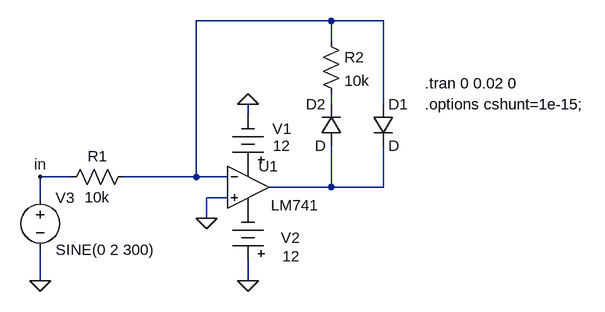
[diagram p0: schematic exp3.asc]
exp3.asc, the LTspice schematic file:
Version 4.1
SHEET 1 1000 780
WIRE 272 -112 64 -112
WIRE 352 -112 272 -112
WIRE 272 -80 272 -112
WIRE 272 16 272 0
WIRE 352 16 352 -112
WIRE 144 32 144 16
WIRE -128 128 -176 128
WIRE 64 128 64 -112
WIRE 64 128 -48 128
WIRE 112 128 64 128
WIRE 272 144 272 80
WIRE 272 144 176 144
WIRE 352 144 352 80
WIRE 352 144 272 144
WIRE -176 160 -176 128
WIRE 112 160 80 160
WIRE 80 192 80 160
WIRE -176 288 -176 240
WIRE 144 288 144 256
FLAG 144 288 0
FLAG 144 16 0
FLAG -176 288 0
FLAG -176 128 in
FLAG 80 192 0
SYMBOL OpAmps\\LM741 144 80 R0
WINDOW 3 35 92 Left 2
SYMATTR InstName U1
SYMBOL Misc\\battery 144 128 R180
WINDOW 0 -67 74 Left 2
WINDOW 3 -65 48 Left 2
WINDOW 123 0 0 Left 0
WINDOW 39 0 0 Left 0
SYMATTR InstName V1
SYMATTR Value 12
SYMBOL Misc\\battery 144 272 R180
WINDOW 0 -80 50 Left 2
WINDOW 3 -80 22 Left 2
WINDOW 123 0 0 Left 0
WINDOW 39 0 0 Left 0
SYMATTR InstName V2
SYMATTR Value 12
SYMBOL res -32 112 R90
WINDOW 0 0 56 VBottom 2
WINDOW 3 32 56 VTop 2
SYMATTR InstName R1
SYMATTR Value 10k
SYMBOL diode 336 16 R0
SYMATTR InstName D1
SYMBOL diode 288 80 R180
WINDOW 0 24 64 Left 2
WINDOW 3 24 0 Left 2
SYMATTR InstName D2
SYMBOL res 256 -96 R0
SYMATTR InstName R2
SYMATTR Value 10k
SYMBOL voltage -176 144 R0
WINDOW 123 0 0 Left 0
WINDOW 39 0 0 Left 0
SYMATTR InstName V3
SYMATTR Value SINE(0 2 300)
TEXT 416 -16 Left 2 !.tran 0 0.02 0
TEXT 416 16 Left 2 !.options cshunt=1e-15;

The netlist it stands for:
* exp3.asc
X§U1 0 N001 P001 P002 N003 LM741  ; pins In+ In- V+ V- OUT
V1 P001 0 12
V2 0 P002 12
R1 N001 in 10k
D1 N001 N003 D
D2 N003 N002 D
R2 N001 N002 10k
V3 in 0 SINE(0 2 300)
.model D D
.lib standard.dio
.tran 0 0.02 0
.options cshunt=1e-15;
.lib LM741.lib
.backanno
.end